# Altium project BB.PrjPCB
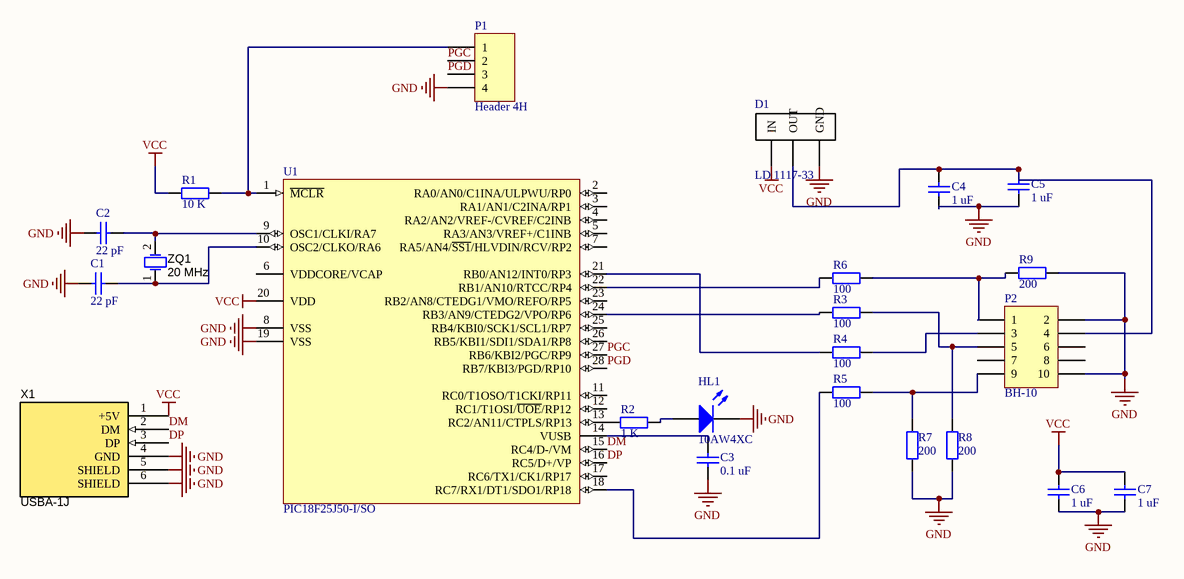
[diagram p0: BB.SchDoc]
1 sheet, 23 parts. Net scope: global (net labels, ports and power ports of the same name join across sheets).
Board file: BB.PcbDoc

## Sheet BB.SchDoc
size A3

### Parts
C1  value 22 pF  [C0805]  (hidden comment: Cap Semi_2)
C2  value 22 pF  [C0805]  (hidden comment: Cap Semi_2)
C3  value 0.1 uF  [C0805]  (hidden comment: Cap Semi_2)
C4  value 1 uF  [C0805]  (hidden comment: Cap Semi_2)
C5  value 1 uF  [C0805]  (hidden comment: Cap Semi_2)
C6  value 1 uF  [C0805]  (hidden comment: Cap Semi_2)
C7  value 1 uF  [C0805]  (hidden comment: Cap Semi_2)
D1  LD 1117-33  [SOT230P700X180-4N]
HL1  10AW4XC  [Led_Rus D=10 d=0.9 w=2.54]
P1  Header 4H  [HDR1X4H]
P2  BH-10  [BH-10 HDR2X5]
R1  value 10 K  [2012[0805] - wa]  (hidden comment: Resistor 0805)
R2  value 1 K  [2012[0805] - wa]  (hidden comment: Resistor 0805)
R3  value 100  [2012[0805] - wa]  (hidden comment: Resistor 0805)
R4  value 100  [2012[0805] - wa]  (hidden comment: Resistor 0805)
R5  value 100  [2012[0805] - wa]  (hidden comment: Resistor 0805)
R6  value 100  [2012[0805] - wa]  (hidden comment: Resistor 0805)
R7  value 200  [2012[0805] - wa]  (hidden comment: Resistor 0805)
R8  value 200  [2012[0805] - wa]  (hidden comment: Resistor 0805)
R9  value 200  [2012[0805] - wa]  (hidden comment: Resistor 0805)
U1  PIC18F25J50-I/SO  [SOIC-SO28_N]
X1  USBA-1J  [USB2.5-2H4C]
ZQ1  20 MHz  [HC49S]

### Nets
GND: C1.2 C2.2 C3.1 C4.1 C5.1 C6.1 C7.1 D1.GND HL1.2(K) P1.4 P2.2 P2.10 R7.1 R8.1 R9.2 U1.8(VSS) U1.19(VSS) X1.4(GND) X1.5(SHIELD) X1.6(SHIELD)
VCC: C6.2 C7.2 D1.IN R1.1 U1.20(VDD) X1.1(+5V)
DM: U1.15(RC4/D-/VM) X1.2(DM)
DP: U1.16(RC5/D+/VP) X1.3(DP)
PGC: P1.2 U1.27(RB6/KBI2/PGC/RP9)
PGD: P1.3 U1.28(RB7/KBI3/PGD/RP10)
NetC1_1: C1.1 U1.10(OSC2/CLKO/RA6) ZQ1.1(OSC1)
NetC2_1: C2.1 U1.9(OSC1/CLKI/RA7) ZQ1.2(OSC2)
NetC3_2: C3.2 U1.14(VUSB)
NetC4_2: C4.2 C5.2 D1.OUT P2.4
NetHL1_1: HL1.1(A) R2.1
NetP1_1: P1.1 R1.2 U1.1(~{MCLR})
NetP2_1: P2.1 R6.2 R9.1
NetP2_3: P2.3 R4.2
NetP2_5: P2.5 R3.2 R8.2
NetP2_9: P2.9 R5.2 R7.2
NetR2_2: R2.2 U1.13(RC2/AN11/CTPLS/RP13)
NetR3_1: R3.1 U1.24(RB3/AN9/CTEDG2/VPO/RP6)
NetR4_1: R4.1 U1.21(RB0/AN12/INT0/RP3)
NetR5_1: R5.1 U1.18(RC7/RX1/DT1/SDO1/RP18)
NetR6_1: R6.1 U1.22(RB1/AN10/RTCC/RP4)

Not connected (* = marked no-connect by the designer): P2 6 7 8; U1 2(RA0/AN0/C1INA/ULPWU/RP0) 3(RA1/AN1/C2INA/RP1) 4(RA2/AN2/VREF-/CVREF/C2INB) 5(RA3/AN3/VREF+/C1INB) 6(VDDCORE/VCAP) 7(RA5/AN4/~{SS1}/HLVDIN/RCV/RP2) 11(RC0/T1OSO/T1CKI/RP11) 12(RC1/T1OSI/~{UOE}/RP12) 17(RC6/TX1/CK1/RP17) 23(RB2/AN8/CTEDG1/VMO/REFO/RP5) 25(RB4/KBI0/SCK1/SCL1/RP7) 26(RB5/KBI1/SDI1/SDA1/RP8)

### Library data of the parts
C1-C7 = Cap Semi_2: Capacitor (Semiconductor SIM Model); Published: 17-Mar-2010; PackageReference: C1206; Publisher: Sergeev
D1 = LD 1117-33: LD 1117-33: 3V3
HL1 = LED D=10: Typical INFRARED GaAs LED; Published: 17-Nov-2010; PackageReference: D=10; Publisher: Сергеев; магазин: http://chip-nn.ru/67.php; Datasheet: http://chip-nn.ru/doc/led/s1206ygsc/s1206ygsc.zip
P1 = Header 4H: Header, 4-Pin, Right Angle; LatestRevisionDate: 17-Jul-2002; LatestRevisionNote: Re-released for DXP Platform.; Publisher: Altium Limited
P2 = BH-10: Header, 5-Pin, Dual row 2.54; LatestRevisionDate: 17-Jul-2002; LatestRevisionNote: Re-released for DXP Platform.; Publisher: Altium Limited
U1 = PIC18F25J50-I/SO: Low Power, High Performance USB Microcontroller with nanoWatt XLP Technology, 28-pin SOIC, Industrial Temperature; Published: 2-Dec-2009; DatasheetVersion: revC, Oct-2009; PackageVersion: revBB, Aug-2009; PackageReference: SOIC-SO28; Publisher: Altium Limited; PackageDescription: 28-Lead Plastic Small Outline (SO) - Wide 7.50mm Body [SOIC]; Supplier 1: Digi-Key; Supplier Part Number 1: PIC18F25J50-I/SO-ND; Supplier 2: Farnell; Supplier Part Number 2: 1778472; Code_JEDEC: MS-013; ComponentLink1Description: Datasheet; ComponentLink1URL: http://ww1.microchip.com/downloads/en/DeviceDoc/39931c.pdf; ComponentLink2Description: Packaging Specification; ComponentLink2URL: http://www.microchip.com/stellent/groups/techpub_sg/documents/packagingspec/en012702.pdf; ComponentLink3Description: Microchip.com Home; ComponentLink3URL: http://www.microchip.com/
X1 = USBA-1J: Разъем USBA на плату; PRICE: 0,1
ZQ1 = XTAL: Crystal Oscillator; Published: 8-Jun-2000; LatestRevisionDate: 17-Jul-2002; LatestRevisionNote: Re-released for DXP Platform.; PackageReference: R38; Publisher: Altium Limited
R1-R9 = Resistor 0805: Product: Сергеев Е. М.